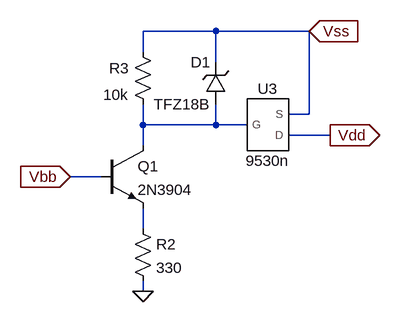
[diagram p0: schematic 9530n_PMOS_HSS.asc]
9530n_PMOS_HSS.asc, the LTspice schematic file:
Version 4
SHEET 1 1160 680
WIRE 48 0 -64 0
WIRE 192 0 48 0
WIRE -64 32 -64 0
WIRE 48 48 48 0
WIRE 192 128 192 0
WIRE 192 128 160 128
WIRE -64 144 -64 112
WIRE 48 144 48 112
WIRE 48 144 -64 144
WIRE 96 144 48 144
WIRE 224 160 160 160
WIRE -64 176 -64 144
WIRE -128 224 -176 224
WIRE -64 304 -64 272
WIRE -64 400 -64 384
FLAG 192 0 Vss
IOPIN 192 0 In
FLAG -176 224 Vbb
IOPIN -176 224 In
FLAG 224 160 Vdd
IOPIN 224 160 Out
FLAG -64 400 0
SYMBOL 9530n 128 144 R0
SYMATTR InstName U3
SYMBOL npn -128 176 R0
SYMATTR InstName Q1
SYMATTR Value 2N3904
SYMBOL res -80 16 R0
WINDOW 0 -36 41 Left 2
WINDOW 3 -45 82 Left 2
SYMATTR InstName R3
SYMATTR Value 10k
SYMBOL zener 64 112 R180
WINDOW 0 24 64 Left 2
WINDOW 3 24 0 Left 2
SYMATTR InstName D1
SYMATTR Value TFZ18B
SYMBOL res -80 288 R0
SYMATTR InstName R2
SYMATTR Value 330

The netlist it stands for:
* 9530n_PMOS_HSS.asc
XU3 Vdd N001 Vss 9530n  ; pins D G S
Q1 N001 Vbb N002 0 2N3904
R3 Vss N001 10k
D1 N001 Vss TFZ18B
R2 N002 0 330
.model D D
.lib standard.dio
.model NPN NPN
.model PNP PNP
.lib standard.bjt
.lib 9530n.spi
.backanno
.end